# EAGLE design tricorder-teensy-mk-1.0 (EAGLE 6.6.0)
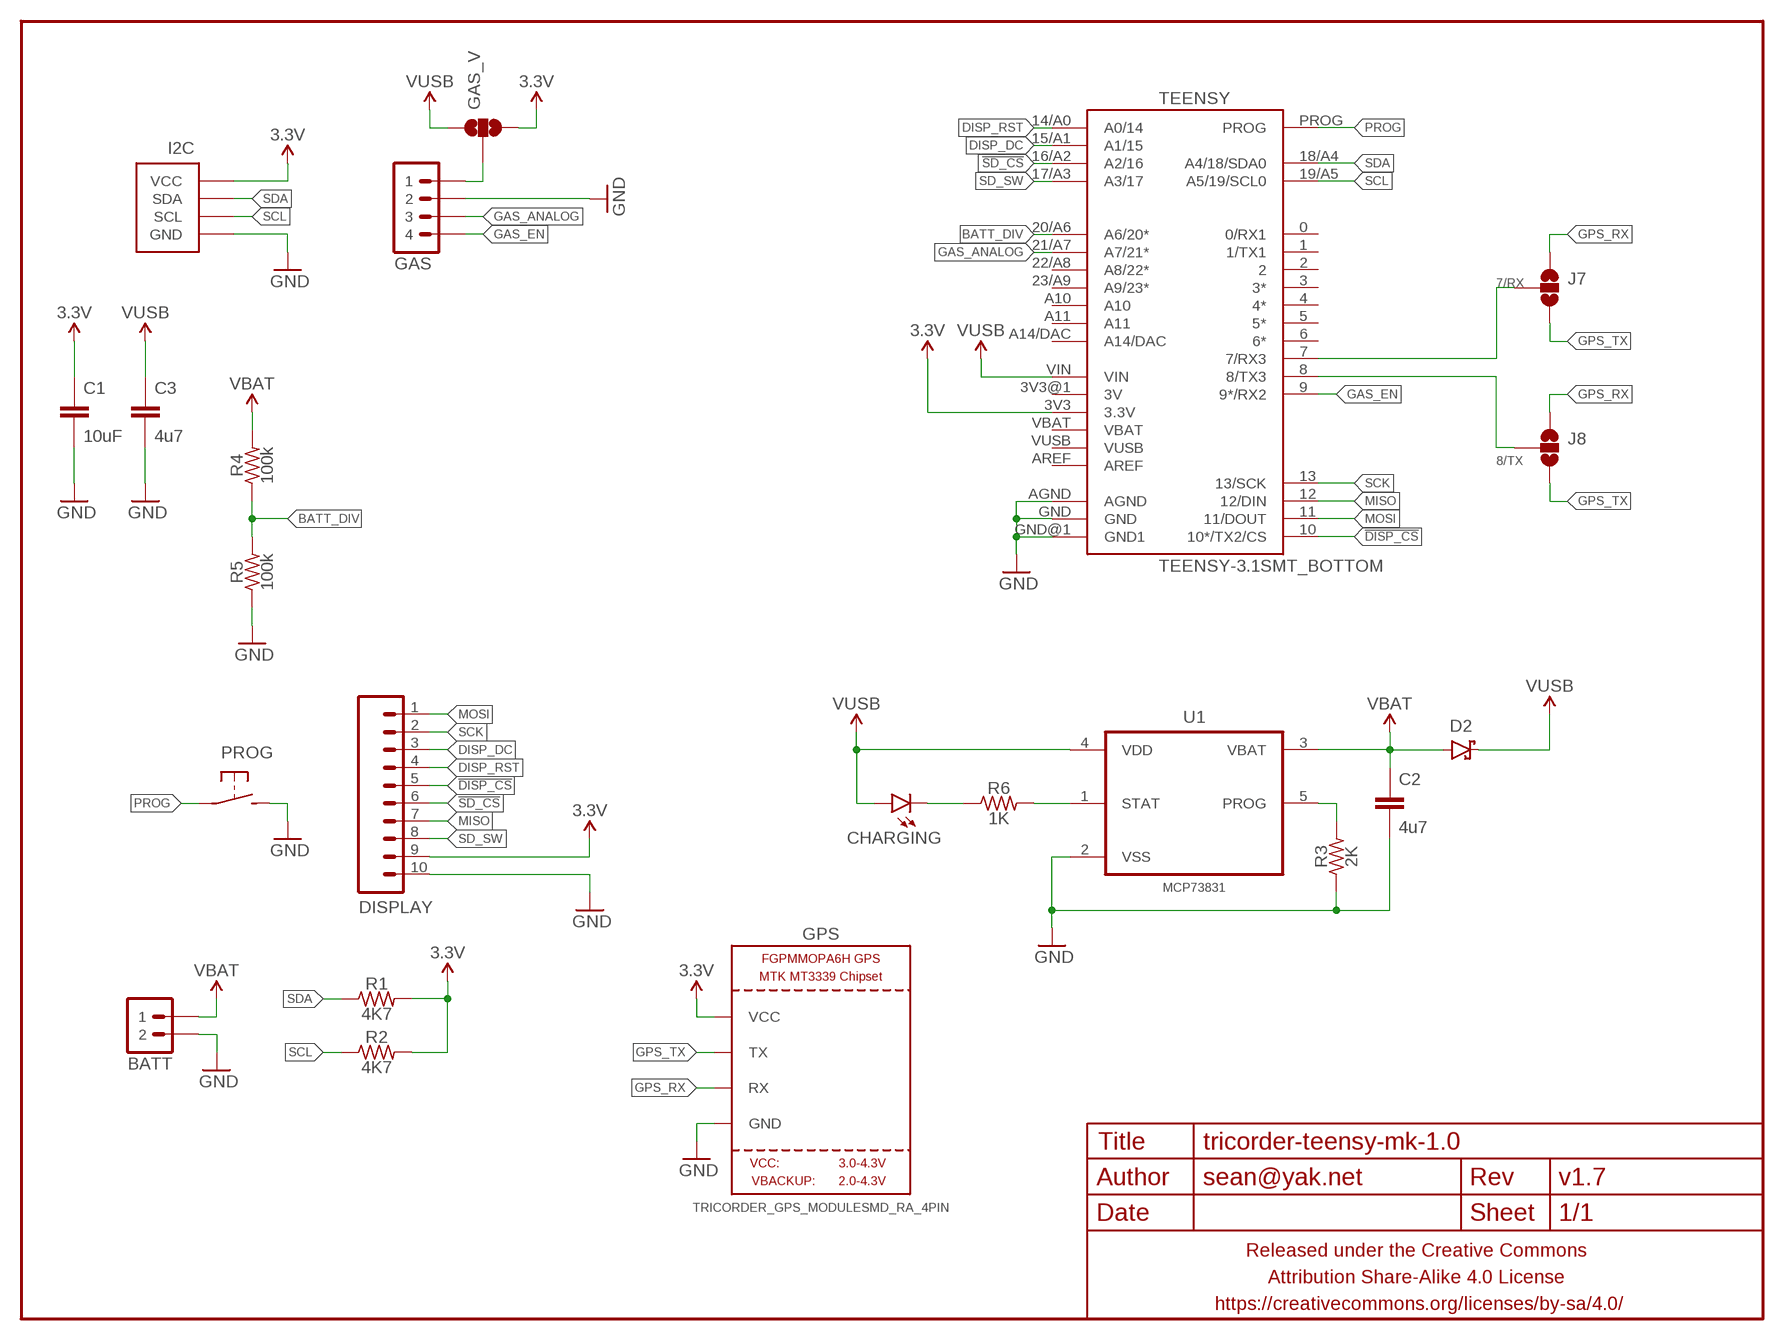
[diagram p0: schematic, sheet 1]

## Parts
BATT  M02JST-2MM-SMT  [JST-2-SMD]
C1  10uF  CAPACITOR-CERAMICC0805-TIGHTER  [C0805-TIGHTER]
C2  4u7  CAPACITOR-CERAMICC0603-TIGHTER  [C0603-TIGHTER]
C3  4u7  CAPACITOR-CERAMICC0603-TIGHTER  [C0603-TIGHTER]
CHARGING  LED0603-TIGHT  [LED-0603-TIGHT]
D2  DIODE-SCHOTTKYSOD323  [SOD323-SCHOTTKY]
DISPLAY  M10SMD_RA_2MM  [1X10_SMD_RA_MALE]
FRAME1  FRAME-LETTERNO_PACKAGE  [DUMMY]
GAS  M04SMD_RA_2MM  [1X04_SMD_RA_2MM]
GAS_V  JUMPER-PAD-3-NOFULL_BOX_SILK  [PAD-JUMPER-3-NO_YES_SILK_FULL_BOX]
GPS  TRICORDER_GPS_MODULESMD_RA_4PIN  [TRICORDER_GPS_MODULE_RA_CONN_SMD_4PIN]
I2C  M04-I2CSMD_2MM_RA  [1X04_SMD_RA_2MM_I2C]
J7  JUMPER-PAD-3-NOFULL_BOX_SILK  [PAD-JUMPER-3-NO_YES_SILK_FULL_BOX]
J8  JUMPER-PAD-3-NOFULL_BOX_SILK  [PAD-JUMPER-3-NO_YES_SILK_FULL_BOX]
PROG  SPST-NO-TACTCK-PTS840-GK  [TACTILE-SMD-CK-PTS840-GK]
R1  4K7  RESISTORR0603-TIGHTER  [R0603-TIGHTER]
R2  4K7  RESISTORR0603-TIGHTER  [R0603-TIGHTER]
R3  2K  RESISTORR0603-TIGHTER  [R0603-TIGHTER]
R4  100k  RESISTORR0603-TIGHTER  [R0603-TIGHTER]
R5  100k  RESISTORR0603-TIGHTER  [R0603-TIGHTER]
R6  1K  RESISTORR0603-TIGHTER  [R0603-TIGHTER]
TEENSY  TEENSY-3.1SMT_BOTTOM  [TEENSY-3.1_SMT_BOTTOM]
U1  MCP73831  MCP73831T-2ACI/OT  [SOT95P280X145-5N]

## Nets
3.3V: C1.1 DISPLAY.9 GAS_V.3 GPS.VCC I2C.VCC R1.2 R2.2 TEENSY.3V3(3.3V)
7/RX: J7.2 TEENSY.7(7/RX3)
8/TX: J8.2 TEENSY.8(8/TX3)
!DISP_CS: DISPLAY.5 TEENSY.10(10*/TX2/CS)
!SD_CS: DISPLAY.6 TEENSY.16/A2(A2/16)
BATT_DIV: R4.1 R5.2 TEENSY.20/A6(A6/20*)
DISP_DC: DISPLAY.3 TEENSY.15/A1(A1/15)
DISP_RST: DISPLAY.4 TEENSY.14/A0(A0/14)
GAS_ANALOG: GAS.3 TEENSY.21/A7(A7/21*)
GAS_EN: GAS.4 TEENSY.9(9*/RX2)
GND: BATT.1 C1.2 C2.2 C3.2 DISPLAY.10 GAS.2 GPS.GND I2C.GND PROG.3 PROG.4 R3.1 R5.1 TEENSY.AGND TEENSY.GND TEENSY.GND@1(GND1) U1.2(VSS)
GPS_RX: GPS.RX J7.1 J8.1
GPS_TX: GPS.TX J7.3 J8.3
MISO: DISPLAY.7 TEENSY.12(12/DIN)
MOSI: DISPLAY.1 TEENSY.11(11/DOUT)
N$1: R6.2 U1.1(STAT)
N$2: CHARGING.C R6.1
N$3: GAS.1 GAS_V.2
N$4: R3.2 U1.5(PROG)
PROG: PROG.1 PROG.2 TEENSY.PROG
SCK: DISPLAY.2 TEENSY.13(13/SCK)
SCL: I2C.SCL R2.1 TEENSY.19/A5(A5/19/SCL0)
SD_SW: DISPLAY.8 TEENSY.17/A3(A3/17)
SDA: I2C.SDA R1.1 TEENSY.18/A4(A4/18/SDA0)
VBAT: BATT.2 C2.1 D2.A R4.2 U1.3(VBAT)
VUSB: C3.1 CHARGING.A D2.C GAS_V.1 TEENSY.VIN U1.4(VDD)
Unconnected: TEENSY.0(0/RX1) TEENSY.1(1/TX1) TEENSY.2 TEENSY.3(3*) TEENSY.3V3@1(3V) TEENSY.4(4*) TEENSY.5(5*) TEENSY.6(6*) TEENSY.22/A8(A8/22*) TEENSY.23/A9(A9/23*) TEENSY.A10 TEENSY.A11 TEENSY.A14/DAC TEENSY.AREF TEENSY.VBAT TEENSY.VUSB

## Library data of the parts
BATT = a_parts:M02: Standard 2-pin 0.1" header. Use with - straight break away headers ( PRT-00116) - right angle break away headers (PRT-00553) - swiss pins (PRT-00743) - machine pins (PRT-00117) - female headers (PRT-00115) Molex polarized connector foot print use with: PRT-08233 with associated crimp pins and housings. 2.54_SCREWTERM for use with PRT-10571. 3.5mm Screw Terminal footprints for PRT-08084 5mm Screw Terminal footprints for use with PRT-08433; PROD_ID: CONN-08352
C1-C3 = a_parts:CAPACITOR-CERAMIC: CAPACITOR, European symbol
CHARGING = a_parts:LED: LEDs Standard schematic elements and footprints for 5mm, 3mm, 1206, and 0603 sized LEDs. 5mm - Spark Fun Electronics SKU : COM-00529 (and others)
D2 = a_parts:DIODE-SCHOTTKY: Schottky diodes in SFE's production catalog BAT20J 1A 23V 0.62Vf RB751 120mA 40V 0.37Vf PMEG4005EJ 0.5A 40V 0.42Vf MBRA140 1A 40V 0.5Vf B340A 3A 40V SMA
DISPLAY = a_parts:M10: Header 10 Standard 10-pin 0.1" header. Use with straight break away headers (SKU : PRT-00116), right angle break away headers (PRT-00553), swiss pins (PRT-00743), machine pins (PRT-00117), and female headers (PRT-00115).
FRAME1 = a_parts:FRAME-LETTER: Schematic Frame Standard 8.5x11 US Letter frame; DESIGNER: sean@yak.net; VERSION: v1.7
GAS = a_parts:M04: Header 4 Standard 4-pin 0.1" header. Use with straight break away headers (SKU : PRT-00116), right angle break away headers (PRT-00553), swiss pins (PRT-00743), machine pins (PRT-00117), and female headers (PRT-00115). Molex polarized connector foot print use with SKU : PRT-08231 with associated crimp pins and housings. 1MM SMD Version SKU: PRT-10208
GAS_V J7 J8 = a_parts:JUMPER-PAD-3-NO
GPS = a_parts:TRICORDER_GPS_MODULE
I2C = a_parts:M04-I2C
PROG = a_parts:SPST-NO-TACT
R1-R6 = a_parts:RESISTOR: RESISTOR, American symbol
TEENSY = a_parts:TEENSY-3.1
U1 = a_parts:MCP73831T-2ACI/OT: Charge Management Controller; MPN: MCP73831T-2ACI/OT; OC_FARNELL: 1332158; OC_NEWARK: 56K7045; PACKAGE: SOT-5; SUPPLIER: Microchip

## Board
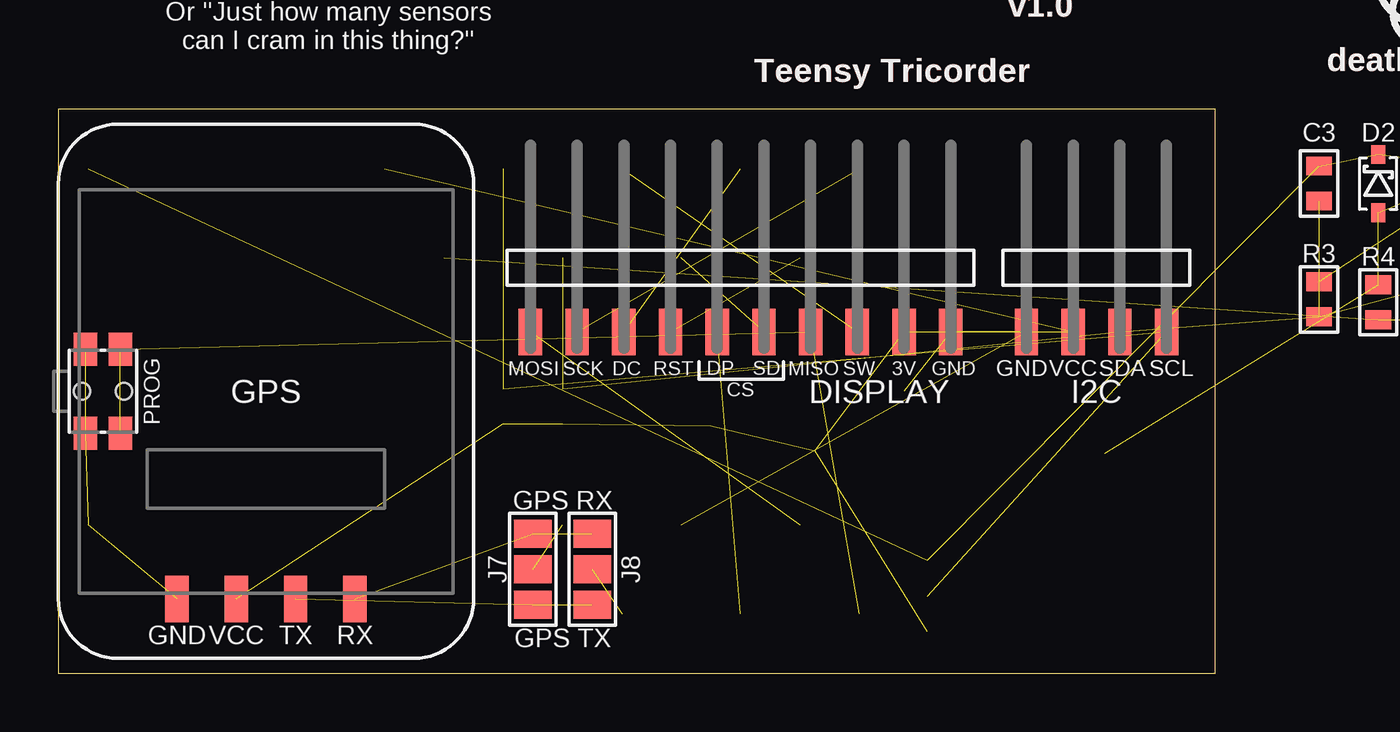
[diagram p1: board, top side]
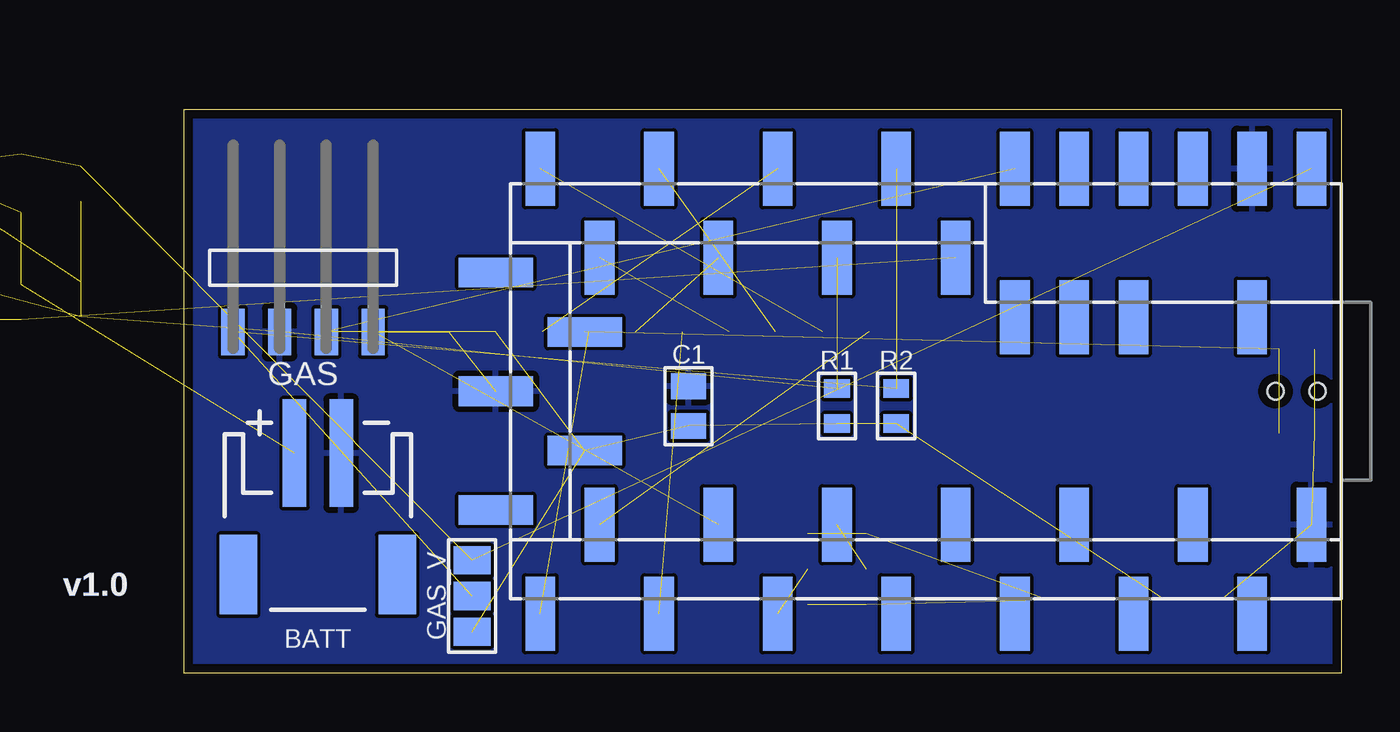
[diagram p2: board, bottom side, seen from below]

Size 49.53 x 24.13 mm. Coordinates in mm from the lower left corner, seen from the top.
Outline: 0,24.13 0,0 49.53,0 49.53,24.13 0,24.13
Copper layers (1*16): Top 0.0356mm / dielectric 1.5011mm / Bottom 0.0356mm
Design rules "LaenPCBOrder2": minimum track width 6mil, minimum drill 13mil, track to track 6mil, track to pad 6mil, pad to pad 6mil, via to via 6mil, smd to smd 6mil, copper to edge 15mil, drill to drill 6mil, minimum pad ring 7mil, minimum via ring 7mil, stop-mask expansion 3mil, vias tented up to drill 20mil, thermal gap 10mil

### Footprints (pad centres in the part's own frame; a part is rotated, then mirrored left to right if it is on the bottom)
JST-2-SMD = smd 1 x 4.6: 1 -1,-3.7; 2 1,-3.7 | smd 1.6 x 3.4: NC1 -3.4,1.5; NC2 3.4,1.5
C0805-TIGHTER = smd 1.1 x 1.5: 1 -0.85,0; 2 0.85,0
C0603-TIGHTER = smd 0.8 x 1.1: 1 -0.75,0; 2 0.75,0
LED-0603-TIGHT = smd 0.8 x 1.1: A 0.75,0; C -0.75,0
SOD323-SCHOTTKY = smd 0.8 x 0.6: A -1.25,0; C 1.25,0
1X10_SMD_RA_MALE = smd 1 x 2: 1 -9,0; 2 -7,0; 3 -5,0; 4 -3,0; 5 -1,0; 6 1,0; 7 3,0; 8 5,0; 9 7,0; 10 9,0
1X04_SMD_RA_2MM = smd 1 x 2: 1 -3,0; 2 -1,0; 3 1,0; 4 3,0
PAD-JUMPER-3-NO_YES_SILK_FULL_BOX = smd 1.2 x 1.6: 1 -1.524,0; 2 0,0; 3 1.524,0
TRICORDER_GPS_MODULE_RA_CONN_SMD_4PIN = smd 1 x 2: GND 3.81,8.89; RX -3.81,8.89; TX -1.27,8.89; VCC 1.27,8.89
1X04_SMD_RA_2MM_I2C = smd 1 x 2: GND -3,0; SCL 3,0; SDA 1,0; VCC -1,0
TACTILE-SMD-CK-PTS840-GK = smd 1.4 x 1: 1 -1.8,0.75; 2 1.8,0.75; 3 -1.8,-0.75; 4 1.8,-0.75 | hole 0.7: 0,-0.9; 0,0.9
R0603-TIGHTER = smd 0.8 x 1.1: 1 -0.75,0; 2 0.75,0
TEENSY-3.1_SMT_BOTTOM = smd 3.175 x 1.27 bottom: 0 9.525,-13.97; 1 5.715,-11.43; 2 9.525,-8.89; 3 5.715,-6.35; 3V3@1 -9.525,-11.43; 4 9.525,-3.81; 5 5.715,-1.27; 6 9.525,1.27; 7 5.715,3.81; 8 9.525,6.35; 9 5.715,8.89; 10 9.525,11.43; 11 5.715,13.97; 12 9.525,16.51; 13 -9.525,16.51; 14/A0 -5.715,13.97; 15/A1 -9.525,11.43; 16/A2 -5.715,8.89; 17/A3 -9.525,6.35; 18/A4 -5.715,3.81; 19/A5 -9.525,1.27; 20/A6 -5.715,-1.27; 21/A7 -9.525,-3.81; 22/A8 -9.525,-6.35; 23/A9 -9.525,-8.89; A10 -3.175,-6.35; A11 -3.175,-3.81; AGND -9.525,-13.97; AREF -3.175,-8.89; GND 5.715,-16.51; VIN -9.525,-16.51; VUSB -3.175,-13.97 | smd 1.27 x 3.175 bottom: 3V3 2.54,14.605; A14/DAC -5.08,18.415; GND@1 0,18.415; PROG -2.54,14.605; VBAT 5.08,18.415
SOT95P280X145-5N = smd 1.3 x 0.55: 1 -1.4,0.95; 2 -1.4,0; 3 -1.4,-0.95; 4 1.4,-0.95; 5 1.4,0.95

### Placement (x,y rotation side)
BATT  43.81,5.71 180 bottom
C1  27.94,11.43 90 bottom
C2  64.14,20.95 270 top  (outside the outline)
C3  53.98,20.95 270 top  (outside the outline)
CHARGING  64.14,15.88 90 top  (outside the outline)
D2  56.52,20.95 90 top  (outside the outline)
DISPLAY  29.21,14.61 0 top
FRAME1  0,0 0 top
GAS  44.45,14.61 0 bottom
GAS_V  37.21,3.3 270 bottom
GPS  8.89,12.06 180 top
I2C  44.45,14.61 0 top
J7  20.32,4.45 270 top
J8  22.86,4.45 270 top
PROG  1.91,12.06 270 top
R1  21.59,11.43 270 bottom
R2  19.05,11.43 270 bottom
R3  53.98,16 90 top  (outside the outline)
R4  56.52,15.88 90 top  (outside the outline)
R5  59.05,15.88 270 top  (outside the outline)
R6  61.59,15.88 90 top  (outside the outline)
TEENSY  17.78,12.06 270 top
U1  60.33,20.95 180 top  (outside the outline)
U$2  [COW_SMALL_METAL]  58.42,30.52 0 top  (outside the outline)

### Tracks (layer width: path | path; a pad name or v marks a point on that pad's centre or on a via)
3.3V  (7 unrouted)
7/RX  (1 unrouted)
8/TX  (1 unrouted)
!DISP_CS  (1 unrouted)
!SD_CS  (1 unrouted)
BATT_DIV  (2 unrouted)
DISP_DC  (1 unrouted)
DISP_RST  (1 unrouted)
GAS_ANALOG  (1 unrouted)
GAS_EN  (1 unrouted)
GND  (10 unrouted)
  pour Bottom: 0,24.13 0,0 49.53,0 49.53,24.13
GPS_RX  (2 unrouted)
GPS_TX  (2 unrouted)
MISO  (1 unrouted)
MOSI  (1 unrouted)
N$1  (1 unrouted)
N$2  (1 unrouted)
N$3  (1 unrouted)
N$4  (1 unrouted)
PROG  (2 unrouted)
SCK  (1 unrouted)
SCL  (2 unrouted)
SD_SW  (1 unrouted)
SDA  (2 unrouted)
VBAT  (4 unrouted)
VUSB  (5 unrouted)

### Text on the board
Top: Teensy Tricorder
tPlace: Or "Just how many sensors / can I cram in this thing?" | Teensy Tricorder | MOSI | SCK | DC | RST | DP | SD | MISO | SW | 3V | GND | CS | GPS RX | GPS TX